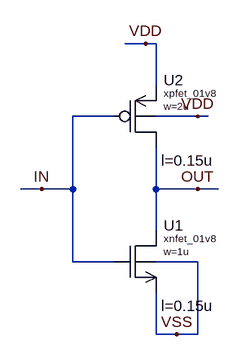
[diagram p0: schematic gate_not_21.asc]
gate_not_21.asc, the LTspice schematic file:
Version 4.1
SHEET 1 880 680
WIRE 320 112 288 112
WIRE 336 112 320 112
WIRE 336 176 336 112
WIRE 272 224 208 224
WIRE 400 224 336 224
WIRE 416 224 400 224
WIRE 160 336 128 336
WIRE 208 336 208 224
WIRE 208 336 160 336
WIRE 336 336 336 272
WIRE 400 336 336 336
WIRE 432 336 400 336
WIRE 336 400 336 336
WIRE 208 448 208 336
WIRE 272 448 208 448
WIRE 400 448 336 448
WIRE 336 560 336 496
WIRE 368 560 336 560
WIRE 400 560 400 448
WIRE 400 560 368 560
FLAG 320 112 VDD
FLAG 400 224 VDD
FLAG 160 336 IN
FLAG 400 336 OUT
FLAG 368 560 VSS
SYMBOL xnch 288 400 R0
WINDOW 123 56 116 Left 2
SYMATTR Value2 l=0.15u
SYMATTR InstName U1
SYMATTR Value w=1u
SYMATTR SpiceModel xnfet_01v8
SYMBOL xpch 288 176 R0
WINDOW 123 56 116 Left 2
SYMATTR Value2 l=0.15u
SYMATTR InstName U2
SYMATTR Value w=2u
SYMATTR SpiceModel xpfet_01v8

The netlist it stands for:
* gate_not_21.asc
X§U1 OUT IN VSS VSS xnfet_01v8 w=1u l=0.15u  ; pins D G S B
X§U2 OUT IN VDD VDD xpfet_01v8 w=2u l=0.15u  ; pins D G S B
.backanno
.end